# Altium schematic sheet LDO.SchDoc: LDO.SchDoc
size A4; Organization: Altium Limited; Address1: L3, 12a Rodborough Rd; Address2: Frenchs Forest; Address3: NSW; Address4: Australia 2086
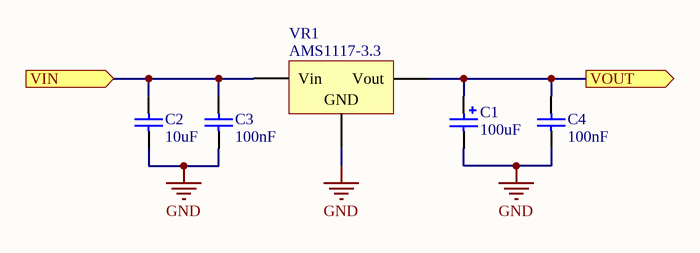
[diagram p0: LDO.SchDoc]

## Parts
C1  100uF  [CASE-B_3528]
C2  10uF  [1206_C]
C3  100nF  [0805_C]
C4  100nF  [1206_C]
VR1  AMS1117-3.3  [SOT-223]

## Ports
VIN (in), VOUT (out)

## Nets
GND: C1.2 C2.1 C3.1 C4.1 VR1.1(GND)
VIN: C2.2 C3.2 VR1.3(Vin) ; port VIN
VOUT: C1.1 C4.2 VR1.2(Vout) ; port VOUT

## Notes on the sheet
- Title
- Size:
- Date:
- A4
- Number:
- Time:
- Revision:
- Sheet
- of
- File:

## Library data of the parts
C1 = 3528 100uF (107) 10% 6.3V: Tantalum capacitor; Manufacturer: AVX; PartNumber: TAJB107K006RNJ; Tolerance: 10%; Voltage: 6.3V; ComponentLink1Description: Supplier link; ComponentLink1URL: http://www.szlcsc.com/product/details_16815.html; Package: 3528; Supplier: LC; SuppliersPartNumber: C16133; Capacitance: 100uF
C2 = 1206 10uF (106) 10% 50V: Chip capacitors; Manufacturer: Samsung Electro-Mechanics; PartNumber: CL31A106KBHNNNE; Tolerance: 10%; Voltage: 50V; ComponentLink1Description: Supplier link; ComponentLink1URL: http://www.szlcsc.com/product/details_14236.html; Package: 1206; Supplier: LC; SuppliersPartNumber: C13585; Capacitance: 10uF
C3 = 0805 100nF(104) 10% 50V: Chip capacitors; Manufacturer: YAGEO; PartNumber: CC0805KRX7R9BB104; Tolerance: 10%; Voltage: 50V; ComponentLink1Description: Supplier link; ComponentLink1URL: http://www.szlcsc.com/product/details_50686.html; Package: 0805; Supplier: LC; SuppliersPartNumber: C49678; Capacitance: 100nF
C4 = 1206 100nF (104) 10% 50V: Chip capacitors; Manufacturer: Samsung Electro-Mechanics; PartNumber: CL31B104KBCNNNC; Tolerance: 10%; Voltage: 50V; ComponentLink1Description: Supplier link; ComponentLink1URL: http://www.szlcsc.com/product/details_25237.html; Package: 1206; Supplier: LC; SuppliersPartNumber: C24497; Capacitance: 100nF
VR1 = SOT-223 AMS1117-3.3: 低压差线性稳压(LDO); ComponentLink1Description: 供应商链接; ComponentLink1URL: http://www.szlcsc.com/product/details_6652.html; Package: SOT-223; Supplier: LC; SuppliersPartNumber: C6186